# Altium schematic sheet MainShunt.SchDoc
size A4; SheetNumber: 7; SheetTotal: 7
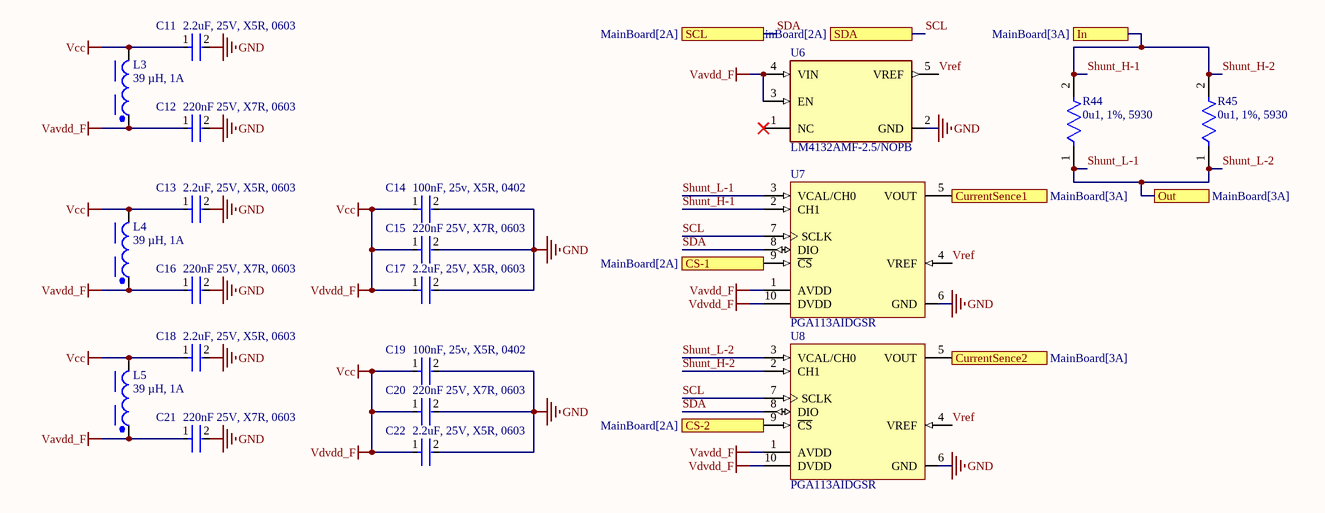
[diagram p0: MainShunt.SchDoc]

## Parts
C11  2.2uF, 25V, X5R, 0603  [FP-GRM188-0_1-e0_2_0_5-MFG]
C12  220nF 25V, X7R, 0603  [FP-GCM188-0_1-IPC_B]
C13  2.2uF, 25V, X5R, 0603  [FP-GRM188-0_1-e0_2_0_5-MFG]
C14  100nF, 25v, X5R, 0402  [FP-GRM155-0_05-IPC_C]
C15  220nF 25V, X7R, 0603  [FP-GCM188-0_1-IPC_B]
C16  220nF 25V, X7R, 0603  [FP-GCM188-0_1-IPC_B]
C17  2.2uF, 25V, X5R, 0603  [FP-GRM188-0_1-e0_2_0_5-MFG]
C18  2.2uF, 25V, X5R, 0603  [FP-GRM188-0_1-e0_2_0_5-MFG]
C19  100nF, 25v, X5R, 0402  [FP-GRM155-0_05-IPC_C]
C20  220nF 25V, X7R, 0603  [FP-GCM188-0_1-IPC_B]
C21  220nF 25V, X7R, 0603  [FP-GCM188-0_1-IPC_B]
C22  2.2uF, 25V, X5R, 0603  [FP-GRM188-0_1-e0_2_0_5-MFG]
L3  39 µH, 1A  [WE-PD_7345]
L4  39 µH, 1A  [WE-PD_7345]
L5  39 µH, 1A  [WE-PD_7345]
R44  0u1, 1%, 5930  [FP-CSS2H-5930K-1L00F-MFG]
R45  0u1, 1%, 5930  [FP-CSS2H-5930K-1L00F-MFG]
U6  LM4132AMF-2.5/NOPB  [FP-DBV0005A-IPC_C]
U7  PGA113AIDGSR  [DGS0010A_L]
U8  PGA113AIDGSR  [DGS0010A_L]

## Ports
CS-1 (see MainBoard[2A]), CS-2 (see MainBoard[2A]), CurrentSence1 (see MainBoard[3A]), CurrentSence2 (see MainBoard[3A]), In (see MainBoard[3A]), Out (see MainBoard[3A]), SCL (see MainBoard[2A]), SDA (see MainBoard[2A])

## Nets
GND: C11.2 C12.2 C13.2 C14.2 C15.2 C16.2 C17.2 C18.2 C19.2 C20.2 C21.2 C22.2 U6.2(GND) U7.6(GND) U8.6(GND)
Vavdd_F: C12.1 C16.1 C21.1 L3.1 L4.1 L5.1 U6.3(EN) U6.4(VIN) U7.1(AVDD) U8.1(AVDD)
Vcc: C11.1 C13.1 C14.1 C15.1 C17.1 C18.1 C19.1 C20.1 C22.1 L3.2 L4.2 L5.2 U7.10(DVDD) U8.10(DVDD)  [also labelled Vdvdd_F]
CS-1: U7.9(~{CS}) ; port CS-1
CS-2: U8.9(~{CS}) ; port CS-2
CurrentSence1: U7.5(VOUT) ; port CurrentSence1
CurrentSence2: U8.5(VOUT) ; port CurrentSence2
SCL: U7.7(SCLK) U8.7(SCLK) ; port SDA
SDA: U7.8(DIO) U8.8(DIO) ; port SCL
Shunt_H-1: R44.2 R45.2 U7.2(CH1) U8.2(CH1) ; port In  [also labelled Shunt_H-2]
Shunt_L-1: R44.1 R45.1 U7.3(VCAL/CH0) U8.3(VCAL/CH0) ; port Out  [also labelled Shunt_L-2]
Vref: U6.5(VREF) U7.4(VREF) U8.4(VREF)

Not connected (* = marked no-connect by the designer): U6 1(NC)*

## Library data of the parts
C11 C13 C17 C18 C22 = CMP-2006-02820-2: Chip Multilayer Ceramic Capacitors for General Purpose, 0603, 2.2uF, X5R, 15%, 10%, 25V; Number of Pins: 2; Dielectric: X5R; Tolerance: 10%; Case Code (Imperial): 0603; Thickness: 0.035inch; Case/Package: 0603; Lead Free: Lead Free; Mount: Surface Mount; Material: Ceramic; Depth: 0.8mm; Voltage: 25V; Capacitance: 2.2uF; Min Operating Temperature: -55°C; Package Quantity: 4000; REACH SVHC: No SVHC; Resistor Type: Ceramic; Packaging: Tape and Reel; Case Code (Metric): 1608; Max Operating Temperature: 85°C; Width: 0.8mm; Termination: SMD/SMT; Voltage Rating: 25V; Length: 1.6mm; Voltage Rating (DC): 25V; Height: 0.8mm; Radiation Hardening: No; Weight: 0.000222oz
C12 C15 C16 C20 C21 = CMP-2006-02366-2: Ceramic Capacitor for Automotive 220nF  ±10% 25VDC X7R 0603 Paper T/R; Capacitance: 220nF; Mount: Surface Mount; Ratings: AEC-Q200; Case/Package: 0603; Packaging: Tape and Reel; Radiation Hardening: No; Voltage: 25V; Dielectric: X7R; Case Code (Imperial): 0603; Max Operating Temperature: 125°C; Min Operating Temperature: -55°C; Depth: 0.8mm; Termination: SMD/SMT; Package Quantity: 1; Case Code (Metric): 1608; Thickness: 0.035inch; Voltage Rating: 25V; Tolerance: 10%; Voltage Rating (DC): 25V; Height: 0.8mm; Lead Free: Lead Free; Length: 1.6mm; Width: 0.031inch
C14 C19 = CMP-06035-003661-1: Chip Multilayer Ceramic Capacitors for General Purpose, 0402, 0.10uF, X7R, 15%, 10%, 25V; Length: 1mm; Depth: 0.5mm; Dielectric: X7R; Voltage Rating: 25V; Lead Free: Lead Free; Case Code (Imperial): 0402; Voltage: 25V; Min Operating Temperature: -55°C; Tolerance: 10%; Dielectric Material: Ceramic; Voltage Rating (DC): 25V; Max Operating Temperature: 125°C; Capacitance: 100nF; Thickness: 0.022inch; Case/Package: 0402; Height: 0.5mm; Resistor Type: Ceramic; Weight: 0.000212oz; Case Code (Metric): 1005; Package Quantity: 10000; Termination: SMD/SMT; Width: 0.02inch; Mount: Surface Mount; Packaging: Tape and Reel
L3-L5 = CMP-0227-00153-2: NexarPartId: 29930417; Max DC Current: 1.11A; Shielding: Shielded; Inductance: 39µH; Self Resonant Frequency: 11MHz; DC Resistance (DCR): 145mΩ; Tolerance: 20%; Ambient Temperature Range Low: -40°C; Width: 7.3mm; Length: 7.3mm; Number of Pins: 2; Packaging: Tape & Reel; Height: 4.5mm; Ambient Temperature Range High: 85°C; Max Operating Temperature: 125°C; Depth: 7.3mm; Min Operating Temperature: -40°C; RoHS: Compliant; Current Rating: 1.11A
R44 R45 = CMP-00059-73869598-1: CSS2H-5930K-1L00F Res Metal Strip 5930 0.001 Ohm 1% 9W ±50ppm/C Pad SMD Automotive T/R; Resistance: 1mΩ; Temperature Coefficient: 50ppm/°C; Case Code (Imperial): 5931; Width: 7.747mm; Min Operating Temperature: -55°C; Tolerance: 1%; Max Power Dissipation: 9W; Case Code (Metric): 1577; Max Operating Temperature: 170°C; NexarPartId: 73869598; Power Rating: 9W; Composition: Metal Element; Case/Package: 5930; Height: 939.8µm; Number of Terminations: 2; Schedule B: 8533210045, 8533210045; Packaging: Cut Tape; REACH SVHC: No SVHC; Features: Moisture Resistant; RoHS: Compliant; Length: 15.0114mm
U6 = CMP-0074-00531-5: IC VREF SERIES 0.05% SOT23-5; Quiescent Current: 100uA; Output Current: 20mA; Number of Channels: 1; Temperature Coefficient: 20ppm/°C; Max Input Voltage: 6V; Output Voltage: 2.5V; Max Supply Voltage: 2.2V; Dropout Voltage: 175mV; Supply Current: 60uA; Output Type: Fixed; Length: 2.92mm; Radiation Hardening: No; Reference Type: Series; Mount: Surface Mount; Packaging: Tape and Reel; Width: 1.6mm; Max Operating Temperature: 125°C; Lead Free: Lead Free; Series: -; Number of Pins: 5; REACH SVHC: No SVHC; Max Output Voltage: 2.5V; Package Quantity: 1000; Tolerance: 0.05%; Min Input Voltage: 2.2V; Case/Package: SOT-23; Termination: SMD/SMT; Height: 1.02mm; Min Output Voltage: 2.5V; Reference Voltage: 2.5V; Max Output Current: 20mA; Nominal Supply Current: 60uA; Min Operating Temperature: -40°C; Operating Supply Current: 100uA
U7 U8 = CMP-0988-00040-2: Zero-Drift, Programmable Gain Amplifier with MUX, -40 to 125 degC, 10-pin SOP (DGS10), Green (RoHS & no Sb/Br); Manufacturer: Texas Instruments; Vs(Max)(V): 5.5; Vs(Min)(V): 2.2; Slew Rate(Typ)(V/us): 3; Input Offset (+/-)(Max)(uV): 100; Common Mode Input High(Min)(V): AVdd -0.1V; Quiescent Current (+/-)(Typ)(mA): 1; Noise at 1kHz(Typ)(nV/rt(Hz)): 13; Gain Error (+/-)(Max)(%): 0.1; Number of Channels: 2; Input Bias Current (+/-)(Max)(nA): 5; Gain(V/V): 1, 2, 5, 10, 20, 50, 100, 200; Settling Time to 0.01%(Typ)(us): 2.55; Non-Linearity (+/-)(Max)(%): 0.0015; Common Mode Input Low(Min)(V): GND + 0.1V; Input Offset Drift (+/-)(Max)(uV/Degrees Celsius): 1.2; Code_JEDEC: MO-153; SubFamily: Programmable Gain Amplifier; ComponentLink2URL: http://www.ti.com/general/docs/lit/getliterature.tsp?genericPartNumber=PGA113&fileType=pdf; ComponentLink2Description: Datasheet; PackageReference: DGS0010A; ComponentLink3Description: Package Specification; ComponentLink1URL: http://www.ti.com/; PackageVersion: 4073272/C, 02/2004; ComponentLink3URL: http://www.ti.com/lit/ml/mpds035b/mpds035b.pdf; PackageDescription: 10-Pin Plastic Small Outline, Body 3 x 3 mm, Pitch 0.5 mm; Eco-Plan: Green (RoHS & no Sb/Br); ComponentLink1Description: Manufacturer URL; Mounting Technology: Surface Mount; PartNumber: PGA113AIDGSR; DatasheetVersion: SBOS424B